# EAGLE design Telescope_Interface_shield (EAGLE 9.6.2)
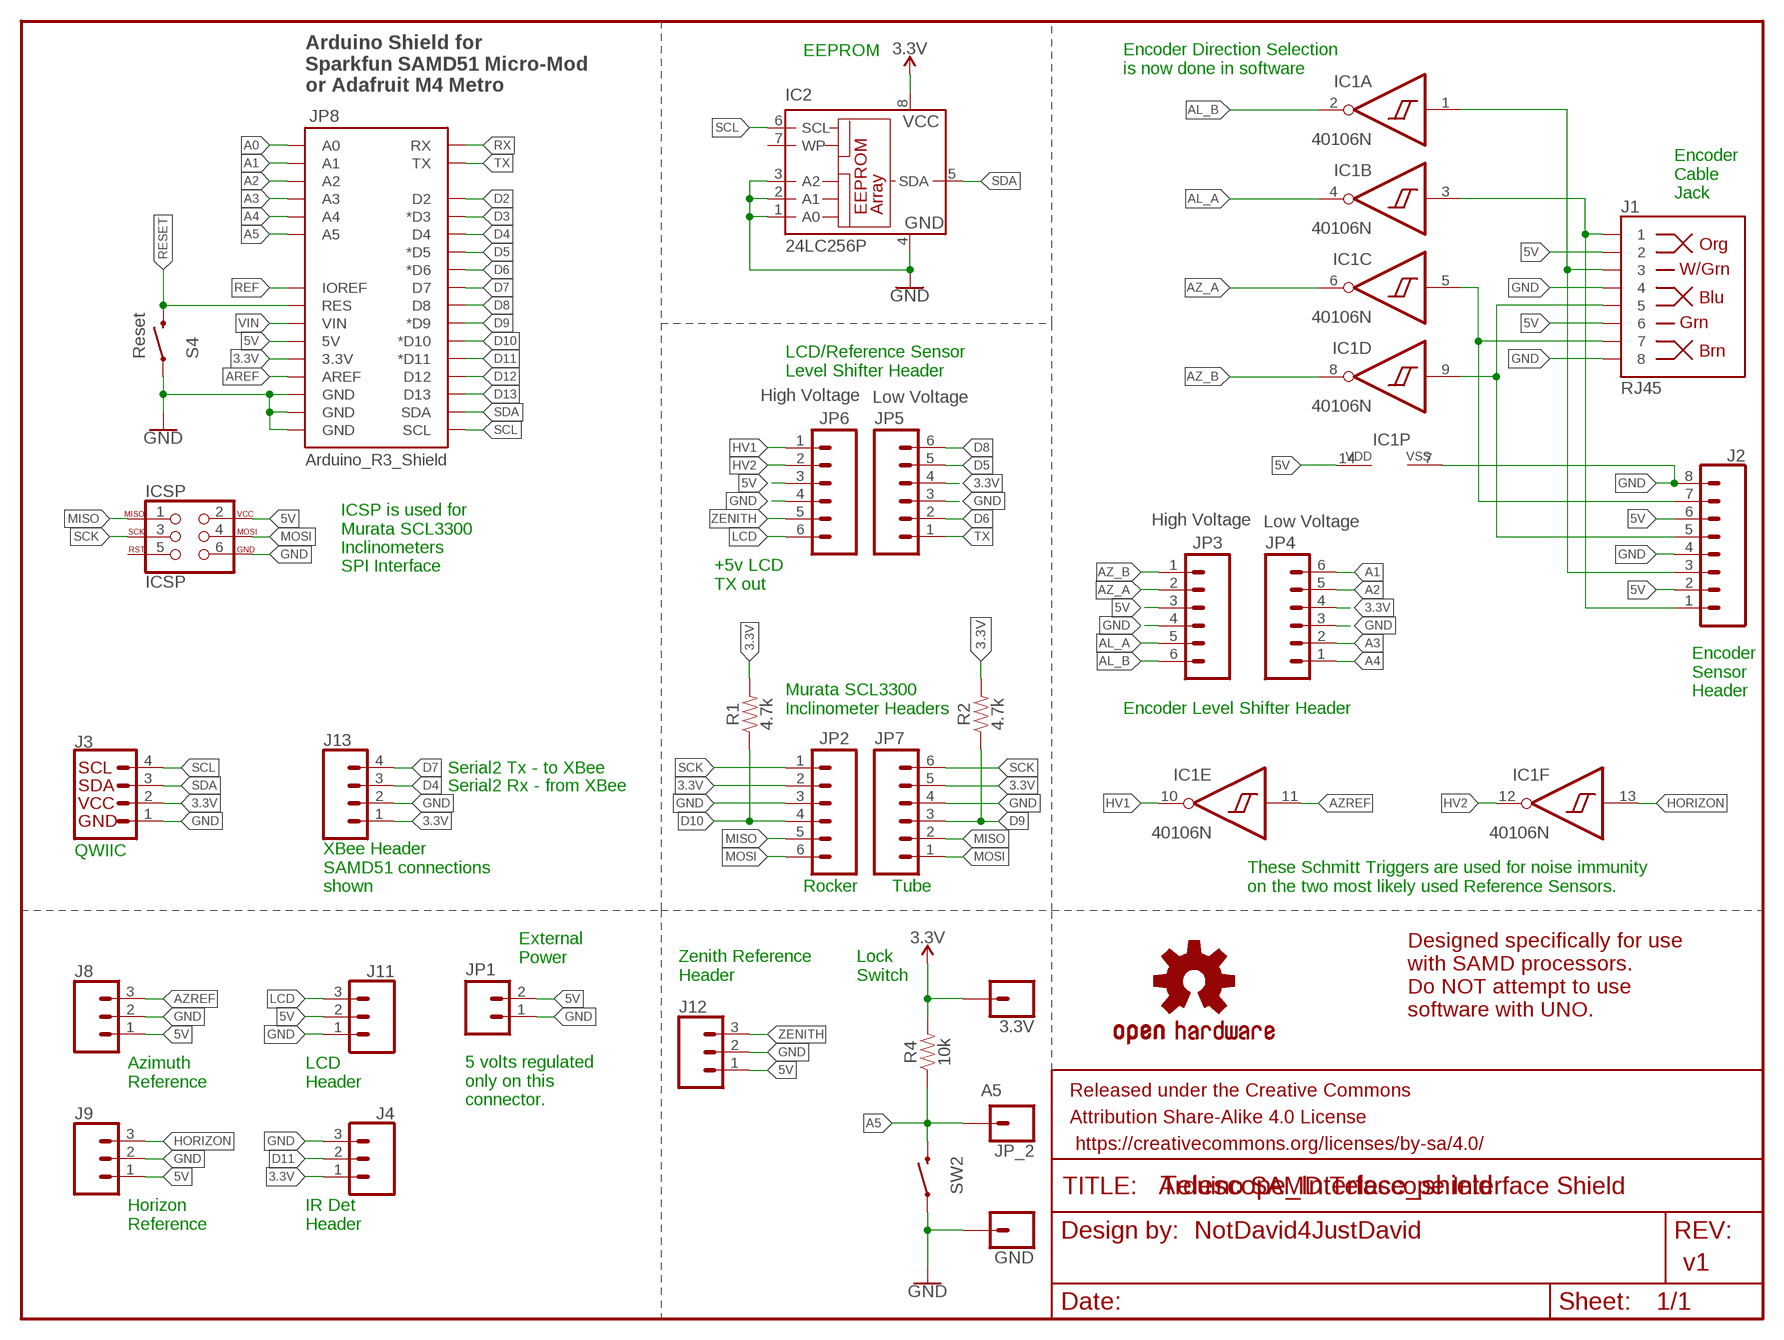
[diagram p0: schematic, sheet 1]

## Parts
3.3V  CONN_01  [1X01]
FRAME1  FRAME-LETTER  [CREATIVE_COMMONS]
GND  CONN_01  [1X01]
IC1  40106N  [DIL14]
IC2  24LC256P  [DIL8]
ICSP  ICSP  AVR_SPI_PROG_3X2PTH  [2X3]
J1  RJ45  RJ45-8  [RJ45-8]
J2  CONN_08"  [1X08]
J3  QWIIC_CONNECTORJS-1MM  [JST04_1MM_RA]
J4  455-1750-1-ND  CONN_03  [1X03]
J8  455-1750-1-ND  CONN_03  [1X03]
J9  455-1750-1-ND  CONN_03  [1X03]
J11  455-1750-1-ND  CONN_03  [1X03]
J12  455-1750-1-ND  CONN_03  [1X03]
J13  CONN_04PTH  [1X04]
JP1  M02JST-PTH-2  [JST-2-PTH]
JP2  M06SIP  [1X06]
JP3  M06SIP  [1X06]
JP4  M06SIP  [1X06]
JP5  M06SIP  [1X06]
JP6  M06SIP  [1X06]
JP7  M06SIP  [1X06]
JP8  ARDUINO_R3_SHIELDR3_PROTO_SHIELD  [UNO_R3_PROTO_SHIELD]
JP_2  CONN_01  [1X01]
LOGO1  OSHW-LOGOS  [OSHW-LOGO-S]
R1  4.7k  4.7KOHM-0603-1/10W-1%  [0603]
R2  4.7k  4.7KOHM-0603-1/10W-1%  [0603]
R4  10k  10KOHM-HORIZ-1/4W-5%  [AXIAL-0.3]
S4  MOMENTARY-SWITCH-SPST-PTH-6.0MM  [TACTILE_SWITCH_PTH_6.0MM]
SW2  MOMENTARY-SWITCH-SPST-PTH-6.0MM  [TACTILE_SWITCH_PTH_6.0MM]

## Nets
3.3V [power]: 3.3V.1 IC2.8(VCC) J3.2 J4.1 J13.1 JP2.2 JP4.4 JP5.4 JP7.5 JP8.3.3V R1.2 R2.2 R4.P$2
5V [power]: IC1.14(P:VDD) ICSP.2 J1.2 J1.6 J2.2 J2.6 J8.1 J9.1 J11.2 J12.1 JP1.2 JP3.3 JP6.3 JP8.5V
A0: JP8.A0
A1: JP4.6 JP8.A1
A2: JP4.5 JP8.A2
A3: JP4.2 JP8.A3
A4: JP4.1 JP8.A4
A5: JP8.A5 JP_2.1 R4.P$1 SW2.3
AL_A: IC1.4(B:O) JP3.5
AL_B: IC1.2(A:O) JP3.6
AREF: JP8.AREF
AZ_A: IC1.6(C:O) JP3.2
AZ_B: IC1.8(D:O) JP3.1
AZREF: IC1.11(E:I) J8.3
D2: JP8.D2
D3: JP8.D3(*D3)
D4: J13.3 JP8.D4
D5: JP5.5 JP8.D5(*D5)
D6: JP5.2 JP8.D6(*D6)
D7: J13.4 JP8.D7
D8: JP5.6 JP8.D8
D9: JP7.3 JP8.D9(*D9) R2.1
D10: JP2.4 JP8.D10(*D10) R1.1
D11: J4.2 JP8.D11(*D11)
D12: JP8.D12
D13: JP8.D13
GND [power]: GND.1 IC1.7(P:VSS) IC2.1(A0) IC2.2(A1) IC2.3(A2) IC2.4(GND) ICSP.6 J1.4 J1.8 J2.4 J2.8 J3.1 J4.3 J8.2 J9.2 J11.1 J12.2 J13.2 JP1.1 JP2.3 JP3.4 JP4.3 JP5.3 JP6.4 JP7.4 JP8.GND@0(GND) JP8.GND@1(GND) JP8.GND@2(GND) S4.1 SW2.1
HORIZON: IC1.13(F:I) J9.3
HV1: IC1.10(E:O) JP6.1
HV2: IC1.12(F:O) JP6.2
LCD: J11.3 JP6.6
MISO: ICSP.1 JP2.5 JP7.2
MOSI: ICSP.4 JP2.6 JP7.1
N$6: IC1.3(B:I) J1.1 J2.1
N$7: IC1.1(A:I) J1.3 J2.3
N$10: IC1.5(C:I) J1.7 J2.7
N$11: IC1.9(D:I) J1.5 J2.5
REF: JP8.IOREF
RESET: JP8.RES S4.3
RX: JP8.RX
SCK: ICSP.3 JP2.1 JP7.6
SCL: IC2.6(SCL) J3.4 JP8.SCL
SDA: IC2.5(SDA) J3.3 JP8.SDA
TX: JP5.1 JP8.TX
VIN: JP8.VIN
ZENITH: J12.3 JP6.5
Unconnected: IC2.7(WP) ICSP.5

## Notes on the sheet
- EEPROM
- Encoder Direction Selection
  is now done in software
- Arduino Shield for
  Sparkfun SAMD51 Micro-Mod
  or Adafruit M4 Metro
- Encoder
  Cable
  Jack
- Reset
- LCD/Reference Sensor
  Level Shifter Header
- High Voltage | Low Voltage
- Arduino_R3_Shield
- High Voltage | Low Voltage
- ICSP is used for
  Murata SCL3300 
  Inclinometers
  SPI Interface
- +5v LCD
  TX out
- Encoder
  Sensor
  Header
- Murata SCL3300
  Inclinometer Headers
- Encoder Level Shifter Header
- Serial2 Tx - to XBee
- Serial2 Rx - from XBee
- QWIIC
- XBee Header
  SAMD51 connections
  shown
- Rocker | Tube
- These Schmitt Triggers are used for noise immunity
  on the two most likely used Reference Sensors.
- External
  Power
- Zenith Reference
  Header
- Lock
  Switch
- Designed specifically for use
  with SAMD processors.
  Do NOT attempt to use
  software with UNO.
- Azimuth
  Reference
- LCD
  Header
- 5 volts regulated
  only on this
  connector.
- Arduino SAMD Telescope Interface Shield
- Horizon
  Reference
- IR Det
  Header

## Library data of the parts
3.3V GND JP_2 = SparkFun-Connectors:CONN_01: Single connection point. Often used as Generic Header-pin footprint for 0.1 inch spaced/style header connections On any of the 0.1 inch spaced packages, you can populate with these: Break Away Headers - Straight <https://www.sparkfun.com/products/116> (PRT-00116) Break Away Male Headers - Right Angle <https://www.sparkfun.com/products/553> (PRT-00553) Female Headers <https://www.sparkfun.com/products/115> (PRT-00115) Break Away Headers - Machine Pin <https://www.sparkfun.com/products/117> (PRT-00117) Break Away Female Headers - Swiss Machine Pin <https://www.sparkfun.com/products/743> (PRT-00743) This device is also useful as a general connection point to wire up your design to another part of your project. Our various solder wires solder well into these plated through hole pads. Hook-Up Wire - Assortment (Stranded, 22 AWG) <https://www.sparkfun.com/products/11375> (PRT-11375) Hook-Up Wire - Assortment (Solid Core, 22 AWG) <https://www.sparkfun.com/products/11367> (PRT-11367) View the entire wire category on our website here <https://www.sparkfun.com/categories/141> Special notes: SMTSO-256-ET is a "flush mount" nut for a 4-40 screw. We mostly use this on specialty testbeds; it is a nice way to connect hardware to your PCB at an adjustable hieght. Also note, the SNAP packages are for using a snappable style connector. We sell a baggie of snaps and they are also used on two LilyPad designs: Snap Assortment - 30 pack (male and female) <https://www.sparkfun.com/products/11347> (DEV-11347) LilyPad Arduino SimpleSnap <https://www.sparkfun.com/products/10941> (DEV-10941) LilyPad SimpleSnap Protoboard <https://www.sparkfun.com/products/10940> (DEV-10940)
FRAME1 = SparkFun-Aesthetics:FRAME-LETTER: Schematic Frame - Letter Standard 8.5x11 US Letter frame; DESIGNER: NotDavid4JustDavid; REV: v1
IC1 = 40xx:40106: Hex SCHMITT TRIGGER
IC2 = microchip:24*: Serial EEPROM I2C; MF: MICROCHIP; MPN: 24LC256-E/P; OC_FARNELL: 9757970; OC_NEWARK: 92C7169
ICSP = SparkFun-Connectors:AVR_SPI_PROG_3X2: AVR ISP 6 Pin This is the reduced ISP connector for AVR programming. Common on Arduino. This footprint will take up less PCB space and can be used with a 10-pin to 6-pin adapter such as SKU: BOB-08508 **Special note about "TEST_POINT" package. The stop mask is on the top side, so if you want your programming test points to be on the bottom of your board, make sure to place this package on the bottom side of the board. This also ensure that the orientation to program from the bottom side will be correct. SparkFun Products: SparkFun ISP Pogo Adapter <https://www.sparkfun.com/products/11591> - NS Tiny AVR Programmer <https://www.sparkfun.com/products/11801> -PTH
J1 = SparkFun-Connectors:RJ45-8: RJ45 Jack - 8 pin Simple RJ45, 8-pin connection. Commonly used for Cat5, Cat5e, and Cat6 Ethernet cables. Here is the connector we sell at SparkFun: RJ45 8-Pin Connector <https://www.sparkfun.com/products/643> (PRT-00643) Datasheet <https://cdn.sparkfun.com/datasheets/Prototyping/04908.pdf> It is used on this SparkFun product: SparkFun RJ45 Breakout <https://www.sparkfun.com/products/716> (BOB-00716) Note, you may also be interested in the "MAGJACK" version of this. It is basically a RJ45 connector, but also has some status LEDs built into the connector housing. You can check that out in this library at the device named "MAGJACK.dev" and see these products online: RJ45 Ethernet MagJack-Compatible <https://www.sparkfun.com/products/8534> (PRT-08534) SparkFun RJ45 MagJack Breakout <https://www.sparkfun.com/products/13021> (BOB-13021); PROD_ID: CONN-08506; SF_ID: PRT-00643
J2 = SparkFun-Connectors:CONN_08: Multi connection point. Often used as Generic Header-pin footprint for 0.1 inch spaced/style header connections On any of the 0.1 inch spaced packages, you can populate with these: Break Away Headers - Straight <https://www.sparkfun.com/products/116> (PRT-00116) Break Away Male Headers - Right Angle <https://www.sparkfun.com/products/553> (PRT-00553) Female Headers <https://www.sparkfun.com/products/115> (PRT-00115) Break Away Headers - Machine Pin <https://www.sparkfun.com/products/117> (PRT-00117) Break Away Female Headers - Swiss Machine Pin <https://www.sparkfun.com/products/743> (PRT-00743) Arduino Stackable Header - 8 Pin <https://www.sparkfun.com/products/9279> (PRT-09279) For SCREWTERMINALS and SPRING TERMINALS visit here: Screw Terimnals on SparkFun.com <https://www.sparkfun.com/search/results?term=Screw+Terminals> (5mm/3.5mm/2.54mm spacing) This device is also useful as a general connection point to wire up your design to another part of your project. Our various solder wires solder well into these plated through hole pads. Hook-Up Wire - Assortment (Stranded, 22 AWG) <https://www.sparkfun.com/products/11375> (PRT-11375) Hook-Up Wire - Assortment (Solid Core, 22 AWG) <https://www.sparkfun.com/products/11367> (PRT-11367) View the entire wire category on our website here <https://www.sparkfun.com/categories/141> Special notes: Molex polarized connector foot print use with SKU : PRT-08231 with associated crimp pins and housings. 1MM SMD Version SKU: PRT-10208 NOTES ON THE VARIANTS LOCK and LOCK_LONGPADS... This footprint was designed to help hold the alignment of a through-hole component (i.e. 6-pin header) while soldering it into place. You may notice that each hole has been shifted either up or down by 0.005 of an inch from it's more standard position (which is a perfectly straight line). This slight alteration caused the pins (the squares in the middle) to touch the edges of the holes. Because they are alternating, it causes a "brace" to hold the component in place. 0.005 has proven to be the perfect amount of "off-center" position when using our standard breakaway headers. Although looks a little odd when you look at the bare footprint, once you have a header in there, the alteration is very hard to notice. Also,if you push a header all the way into place, it is covered up entirely on the bottom side.; PROD_ID: CONN-08438
J3 = SparkFun-Connectors:QWIIC_CONNECTOR: SparkFun I2C Standard Qwiic Connector An SMD 1mm pitch JST connector makes it easy and quick (get it? Qwiic?) to connect I2C devices to each other. The Qwiic system <http://www.sparkfun.com/qwiic> enables fast and solderless connection between popular platforms and various sensors and actuators. We carry 200mm <https://www.sparkfun.com/products/14204>, 100mm <https://www.sparkfun.com/products/14205>, 50mm <https://www.sparkfun.com/products/14206>, and breadboard friendly <https://www.sparkfun.com/products/14207> Qwiic cables. We also offer 10 pcs strips <https://www.sparkfun.com/products/14323> the SMD connectors.; PROD_ID: CONN-13694
J4 J8 J9 J11 J12 = SparkFun-Connectors:CONN_03: Multi connection point. Often used as Generic Header-pin footprint for 0.1 inch spaced/style header connections On any of the 0.1 inch spaced packages, you can populate with these: Break Away Headers - Straight <https://www.sparkfun.com/products/116> (PRT-00116) Break Away Male Headers - Right Angle <https://www.sparkfun.com/products/553> (PRT-00553) Female Headers <https://www.sparkfun.com/products/115> (PRT-00115) Break Away Headers - Machine Pin <https://www.sparkfun.com/products/117> (PRT-00117) Break Away Female Headers - Swiss Machine Pin <https://www.sparkfun.com/products/743> (PRT-00743) Stackable Header - 3 Pin (Female, 0.1") <https://www.sparkfun.com/products/13875> (PRT-13875) For SCREWTERMINALS and SPRING TERMINALS visit here: Screw Terimnals on SparkFun.com <https://www.sparkfun.com/search/results?term=Screw+Terminals> (5mm/3.5mm/2.54mm spacing) This device is also useful as a general connection point to wire up your design to another part of your project. Our various solder wires solder well into these plated through hole pads. Hook-Up Wire - Assortment (Stranded, 22 AWG) <https://www.sparkfun.com/products/11375> (PRT-11375) Hook-Up Wire - Assortment (Solid Core, 22 AWG) <https://www.sparkfun.com/products/11367> (PRT-11367) View the entire wire category on our website here <https://www.sparkfun.com/categories/141> Special notes: Molex polarized connector foot print use with SKU : PRT-08232 with associated crimp pins and housings.; PROD_ID: XXX-00000
J13 = SparkFun-Connectors:CONN_04: Multi connection point. Often used as Generic Header-pin footprint for 0.1 inch spaced/style header connections On any of the 0.1 inch spaced packages, you can populate with these: Break Away Headers - Straight <https://www.sparkfun.com/products/116> (PRT-00116) Break Away Male Headers - Right Angle <https://www.sparkfun.com/products/553> (PRT-00553) Female Headers <https://www.sparkfun.com/products/115> (PRT-00115) Break Away Headers - Machine Pin <https://www.sparkfun.com/products/117> (PRT-00117) Break Away Female Headers - Swiss Machine Pin <https://www.sparkfun.com/products/743> (PRT-00743) For SCREWTERMINALS and SPRING TERMINALS visit here: Screw Terimnals on SparkFun.com <https://www.sparkfun.com/search/results?term=Screw+Terminals> (5mm/3.5mm/2.54mm spacing) This device is also useful as a general connection point to wire up your design to another part of your project. Our various solder wires solder well into these plated through hole pads. Hook-Up Wire - Assortment (Stranded, 22 AWG) <https://www.sparkfun.com/products/11375> (PRT-11375) Hook-Up Wire - Assortment (Solid Core, 22 AWG) <https://www.sparkfun.com/products/11367> (PRT-11367) View the entire wire category on our website here <https://www.sparkfun.com/categories/141> Special notes: Molex polarized connector foot print use with SKU : PRT-08231 with associated crimp pins and housings. 1MM SMD Version SKU: PRT-10208; PROD_ID: CONN-09696
JP1 = SparkFun-Connectors:M02: Standard 2-pin 0.1" header. Use with - straight break away headers ( PRT-00116) - right angle break away headers (PRT-00553) - swiss pins (PRT-00743) - machine pins (PRT-00117) - female headers (PRT-00115) Molex polarized connector foot print use with: PRT-08233 with associated crimp pins and housings. 2.54_SCREWTERM for use with PRT-10571. 3.5mm Screw Terminal footprints for PRT-08084 5mm Screw Terminal footprints for use with PRT-08432; PROD_ID: CONN-09863; SKU: PRT-09914
JP2-JP7 = SparkFun:M06: Header 6 Standard 6-pin 0.1" header. Use with straight break away headers (SKU : PRT-00116), right angle break away headers (PRT-00553), swiss pins (PRT-00743), machine pins (PRT-00117), and female headers (PRT-00115). Molex polarized connector foot print use with SKU : PRT-08094 with associated crimp pins and housings. NOTES ON THE VARIANTS LOCK and LOCK_LONGPADS... This footprint was designed to help hold the alignment of a through-hole component (i.e. 6-pin header) while soldering it into place. You may notice that each hole has been shifted either up or down by 0.005 of an inch from it's more standard position (which is a perfectly straight line). This slight alteration caused the pins (the squares in the middle) to touch the edges of the holes. Because they are alternating, it causes a "brace" to hold the component in place. 0.005 has proven to be the perfect amount of "off-center" position when using our standard breakaway headers. Although looks a little odd when you look at the bare footprint, once you have a header in there, the alteration is very hard to notice. Also, if you push a header all the way into place, it is covered up entirely on the bottom side. This idea of altering the position of holes to aid alignment will be further integrated into the Sparkfun Library for other footprints. It can help hold any component with 3 or more connection pins.
JP8 = TempLibrary:ARDUINO_R3_SHIELD: Shield form compatible with the Arduino Uno R3.
LOGO1 = SparkFun-Aesthetics:OSHW-LOGO: Open-Source Hardware (OSHW) Logo This logo indicates the piece of hardware it is found on incorporates a OSHW license and/or adheres to the definition of open source hardware found here: http://freedomdefined.org/OSHW
R1 R2 = SparkFun-Resistors:4.7KOHM: 4.7kΩ resistor A resistor is a passive two-terminal electrical component that implements electrical resistance as a circuit element. Resistors act to reduce current flow, and, at the same time, act to lower voltage levels within circuits. - Wikipedia; PROD_ID: RES-07857
R4 = SparkFun-Resistors:10KOHM: 10kΩ resistor A resistor is a passive two-terminal electrical component that implements electrical resistance as a circuit element. Resistors act to reduce current flow, and, at the same time, act to lower voltage levels within circuits. - Wikipedia; PROD_ID: RES-09435
S4 SW2 = SparkFun-Switches:MOMENTARY-SWITCH-SPST: Momentary Switch (Pushbutton) - SPST Normally-open (NO) SPST momentary switches (buttons, pushbuttons). Variants PTH-12MM - 12mm square, through-hole Momentary Pushbutton Switch - 12mm Square <https://www.sparkfun.com/products/9190> (COM-09190) PTH-6.0MM, PTH-6.0MM-KIT - 6.0mm square, through-hole Mini Pushbutton Switch <https://www.sparkfun.com/products/97> (COM-00097) KIT package intended for soldering kit's - only one side of pads' copper is exposed. PTH-RIGHT-ANGLE-KIT - Right-angle, through-hole Right Angle Tactile Button <https://www.sparkfun.com/products/10791> - Used on SparkFun BigTime Watch Kit <https://www.sparkfun.com/products/11734> SMD-12MM - 12mm square, surface-mount Tactile Button - SMD (12mm) <https://www.sparkfun.com/products/12993> (COM-12993) Used on SparkFun PicoBoard <https://www.sparkfun.com/products/11888> SMD-4.5MM - 4.5mm Square Trackball Switch Used on SparkFun Blackberry Trackballer Breakout <https://www.sparkfun.com/products/13169> SMD-4.6MMX2.8MM - 4.60mm x 2.80mm, surface mount Used on SparkFun SAMD21 Mini Breakout <https://www.sparkfun.com/products/13664> SMD-5.2MM, SMD-5.2-REDUNDANT - 5.2mm square, surface-mount Mini Pushbutton Switch - SMD <https://www.sparkfun.com/products/8720> (COM-08720) Used on Arduino Pro Mini <https://www.sparkfun.com/products/11114> REDUNDANT package connects both switch circuits together SMD-6.0X3.5MM - 6.0 x 3.5mm, surface mount Momentary Reset Switch SMD <https://www.sparkfun.com/products/8229> (COM-08229) SMD-6.2MM-TALL - 6.2mm square, surface mount Tactile Button - SMD (6mm) <https://www.sparkfun.com/products/12992> Used on SparkFun Digital Sandbox <https://www.sparkfun.com/products/12651> SMD-RIGHT-ANGLE - Right-angle, surface mount Used on SparkFun Block for Intel® Edison - Arduino <https://www.sparkfun.com/products/13036>; PROD_ID: SWCH-08441; SF_SKU: COM-00097

## Net classes
0 default: clearance 0.205 mm
1 power: width 0.254 mm, clearance 0.205 mm to class 0, clearance 0.205 mm

## Board
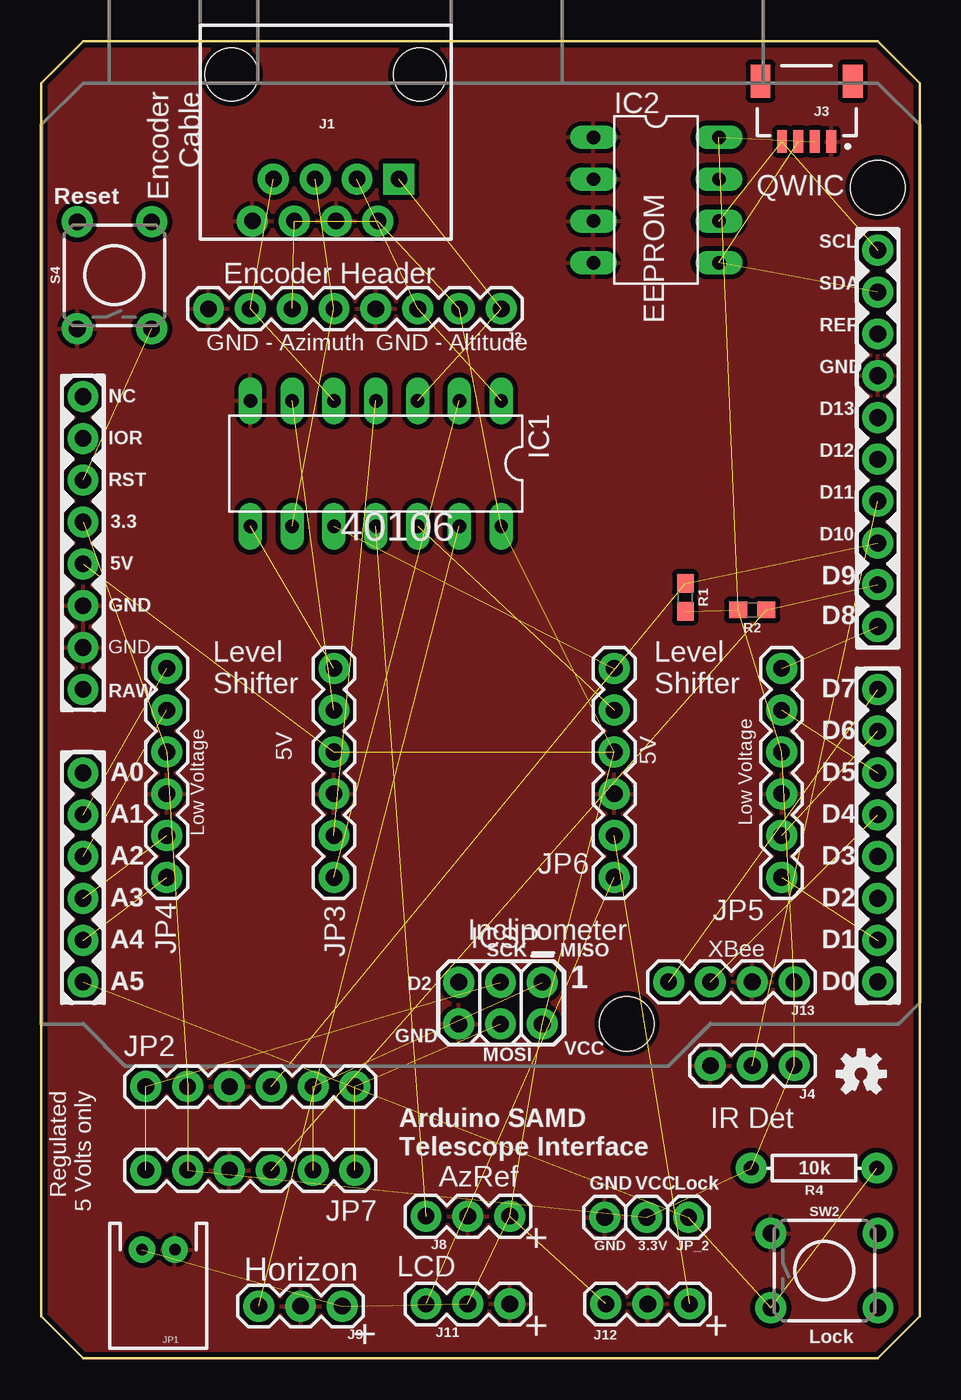
[diagram p1: board, top side]
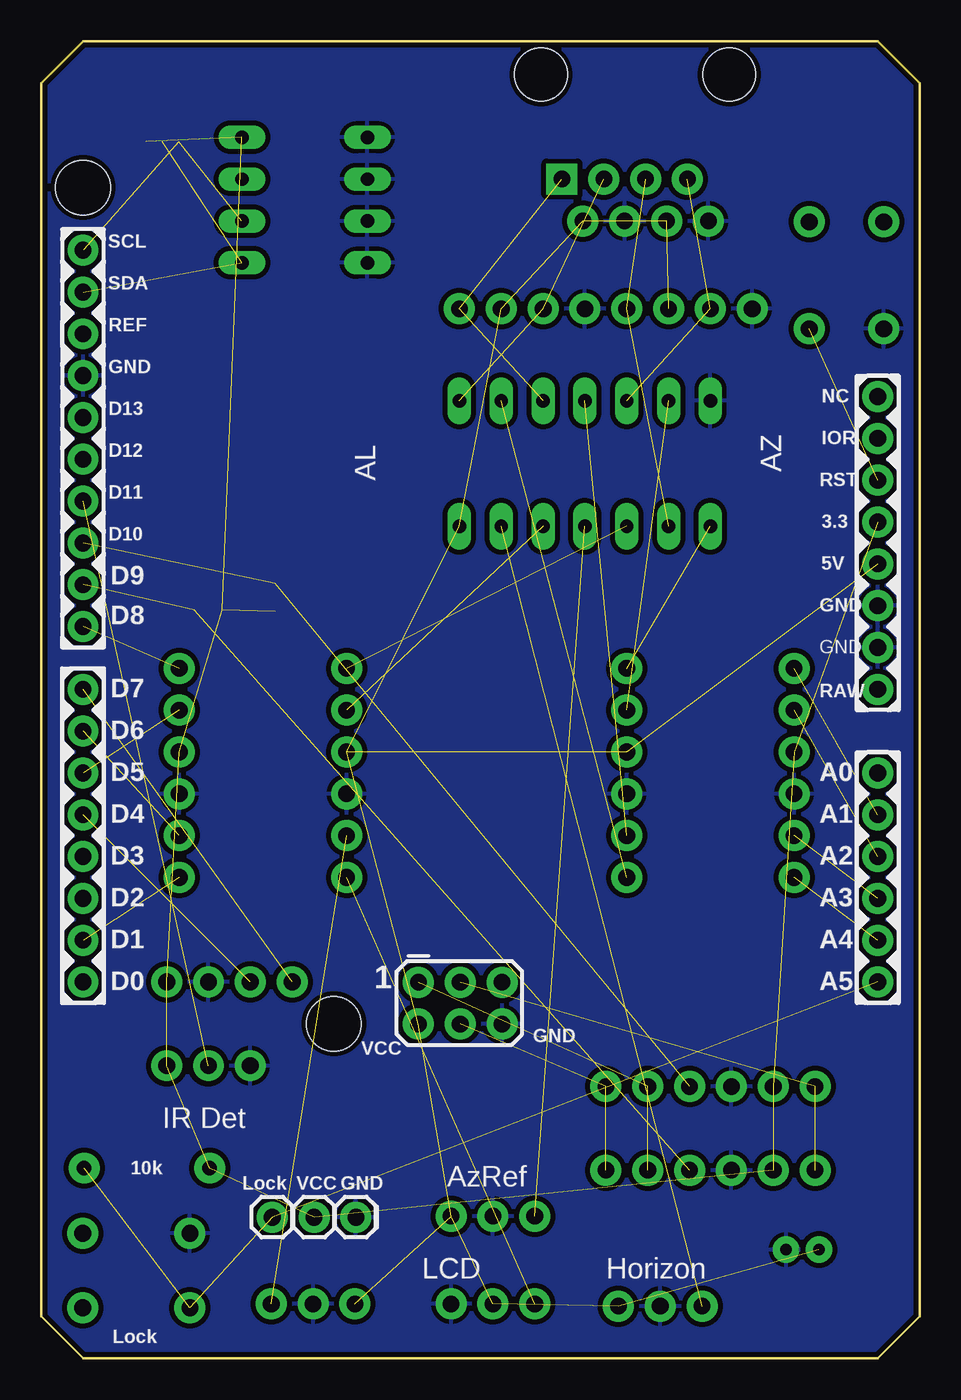
[diagram p2: board, bottom side, seen from below]

Size 53.34 x 80.01 mm. Coordinates in mm from the lower left corner, seen from the top.
Outline: 2.54,0 50.8,0 53.34,2.54 53.34,77.47 50.8,80.01 2.54,80.01 0,77.47 0,2.54 2.54,0
Copper layers (1*16): Top 0.035mm / dielectric 1.5mm / Bottom 0.035mm
Design rules "SparkFun": minimum track width 8mil, minimum drill 20mil, track to track 8mil, track to pad 8mil, pad to pad 8mil, via to via 8mil, smd to smd 8mil, copper to edge 8mil, drill to drill 8mil, minimum pad ring 12mil, minimum via ring 10mil, stop-mask expansion 4mil, vias tented up to drill 20mil, thermal gap 10mil

### Footprints (pad centres in the part's own frame; a part is rotated, then mirrored left to right if it is on the bottom)
1X01 = drill 1.016 pad 1.88: 1 0,0
DIL14 = drill 0.813 long: 1 -7.62,-3.81; 2 -5.08,-3.81; 3 -2.54,-3.81; 4 0,-3.81; 5 2.54,-3.81; 6 5.08,-3.81; 7 7.62,-3.81; 8 7.62,3.81; 9 5.08,3.81; 10 2.54,3.81; 11 0,3.81; 12 -2.54,3.81; 13 -5.08,3.81; 14 -7.62,3.81
DIL8 = drill 0.813 long: 1 -3.81,-3.81; 2 -1.27,-3.81; 3 1.27,-3.81; 4 3.81,-3.81; 5 3.81,3.81; 6 1.27,3.81; 7 -1.27,3.81; 8 -3.81,3.81
2X3 = drill 1.016 pad 1.88: 1 0,0; 2 0,2.54; 3 2.54,0; 4 2.54,2.54; 5 5.08,0; 6 5.08,2.54
RJ45-8 = drill 1 pad 1.88 square: 1 -4.445,6.35 | drill 1 pad 1.88: 2 -3.175,8.89; 3 -1.905,6.35; 4 -0.635,8.89; 5 0.635,6.35; 6 1.905,8.89; 7 3.175,6.35; 8 4.445,8.89 | hole 3.2: -5.715,0; 5.715,0
1X08 = drill 1.016 pad 1.88: 1 0,0; 2 2.54,0; 3 5.08,0; 4 7.62,0; 5 10.16,0; 6 12.7,0; 7 15.24,0; 8 17.78,0
JST04_1MM_RA = smd 0.6 x 1.35: 1 -1.5,0; 2 -0.5,0; 3 0.5,0; 4 1.5,0 | smd 1.2 x 2: NC1 2.8,-3.675; NC2 -2.8,-3.675
1X03 = drill 1.016 pad 1.88: 1 0,0; 2 2.54,0; 3 5.08,0
1X04 = drill 1.016 pad 1.88: 1 0,0; 2 2.54,0; 3 5.08,0; 4 7.62,0
JST-2-PTH = drill 0.7 pad 1.6: 1 -1,0; 2 1,0
1X06 = drill 1.016 pad 1.88: 1 0,0; 2 2.54,0; 3 5.08,0; 4 7.62,0; 5 10.16,0; 6 12.7,0
UNO_R3_PROTO_SHIELD = drill 1.016 pad 1.88: 3.3V 50.8,26.67; 5V 50.8,29.21; A0 50.8,41.91; A1 50.8,44.45; A2 50.8,46.99; A3 50.8,49.53; A4 50.8,52.07; A5 50.8,54.61; AREF 2.54,15.24; D2 2.54,49.53; D3 2.54,46.99; D4 2.54,44.45; D5 2.54,41.91; D6 2.54,39.37; D7 2.54,36.83; D8 2.54,33.02; D9 2.54,30.48; D10 2.54,27.94; D11 2.54,25.4; D12 2.54,22.86; D13 2.54,20.32; GND@0 50.8,31.75; GND@1 50.8,34.29; GND@2 2.54,17.78; IOREF 50.8,21.59; NC 50.8,19.05; RES 50.8,24.13; RX 2.54,54.61; SCL 2.54,10.16; SDA 2.54,12.7; TX 2.54,52.07; VIN 50.8,36.83 | hole 3.302: 2.54,6.35; 17.78,57.15
0603 = smd 1.1 x 1: 1 -0.85,0; 2 0.85,0
AXIAL-0.3 = drill 0.9 pad 1.88: P$1 -3.81,0; P$2 3.81,0
TACTILE_SWITCH_PTH_6.0MM = drill 1.016 pad 1.88: 1 -3.251,2.261; 2 3.251,2.261; 3 -3.251,-2.261; 4 3.251,-2.261

### Placement (x,y rotation side)
3.3V  36.77,8.57 180 top
FRAME1  -2.01,-13.08 0 top  (outside the outline)
GND  34.23,8.57 180 top
IC1  20.32,54.36 180 top
IC2  37.34,70.36 270 top
ICSP  30.43,22.85 180 top
J1  17.27,77.98 180 top
J2  27.94,63.75 180 top
J3  46.48,73.91 180 top
J4  45.72,17.78 180 top
J8  28.45,8.64 180 top
J9  18.29,3.17 180 top
J11  28.45,3.3 180 top
J12  34.29,3.3 0 top
J13  45.72,22.86 180 top
JP1  7.11,6.6 180 top
JP2  6.35,16.51 0 top
JP3  17.78,41.91 270 top
JP4  7.62,29.21 90 top
JP5  44.96,29.21 90 top
JP6  34.8,41.91 270 top
JP7  19.05,11.43 180 top
JP8  53.34,77.47 180 top
JP_2  39.31,8.57 180 top
LOGO1  49.78,17.27 0 top
R1  39.12,46.23 270 top
R2  43.18,45.47 180 top
R4  46.93,11.56 180 top
S4  4.45,65.79 90 top
SW2  47.56,5.33 0 top

### Tracks (layer width: path | path; a pad name or v marks a point on that pad's centre or on a via)
3.3V  (12 unrouted)
5V  (13 unrouted)
A1  (1 unrouted)
A2  (1 unrouted)
A3  (1 unrouted)
A4  (1 unrouted)
A5  (3 unrouted)
AL_A  (1 unrouted)
AL_B  (1 unrouted)
AZ_A  (1 unrouted)
AZ_B  (1 unrouted)
AZREF  (1 unrouted)
D4  (1 unrouted)
D5  (1 unrouted)
D6  (1 unrouted)
D7  (1 unrouted)
D8  (1 unrouted)
D9  (2 unrouted)
D10  (2 unrouted)
D11  (1 unrouted)
GND
  pour Top (isolate 0.305): 53.34,0 0,0 0,80.01 53.34,80.01
  pour Bottom (isolate 0.305): 53.34,0 0,0 0,80.01 53.34,80.01
HORIZON  (1 unrouted)
HV1  (1 unrouted)
HV2  (1 unrouted)
LCD  (1 unrouted)
MISO  (2 unrouted)
MOSI  (2 unrouted)
N$6  (2 unrouted)
N$7  (2 unrouted)
N$10  (2 unrouted)
N$11  (2 unrouted)
RESET  (1 unrouted)
SCK  (2 unrouted)
SCL  (2 unrouted)
SDA  (2 unrouted)
TX  (1 unrouted)
ZENITH  (1 unrouted)

### Text on the board
Unrouted: Rocker | Tube
tPlace: QWIIC | EEPROM | Reset | Encoder / Cable | SCL | Encoder Header | SDA | REF | GND - Azimuth | GND - Altitude | GND | NC | D13 | IOR | D12 | RST | D11 | 3.3 | 40106 | D10 | 5V | D9 | GND | D8 | GND | RAW | Level / Shifter | Level / Shifter | D7 | D6 | 5V | 5V | A0 | D5 | A1 | D4 | Low Voltage | Low Voltage | A2 | D3 | A3 | D2 | A4 | Inclinometer | XBee | D1 | SCK | MISO | A5 | D2 | 1 | D0 | GND | MOSI | VCC | Regulated / 5 Volts only | IR Det | Arduino SAMD / Telescope Interface | 10k | AzRef | GND | VCC | Lock | + | Horizon | LCD | Lock | + | + | +
bPlace: SCL | SDA | REF | GND | NC | D13 | IOR | AL | D12 | AZ | RST | D11 | 3.3 | D10 | 5V | D9 | GND | D8 | GND | RAW | D7 | D6 | A0 | D5 | A1 | D4 | A2 | D3 | A3 | D2 | A4 | D1 | A5 | 1 | D0 | GND | VCC | IR Det | 10k | AzRef | GND | VCC | Lock | Horizon | LCD | Lock
Measures: Dimensions in Inches